# Altium project EzRing.PrjPcb
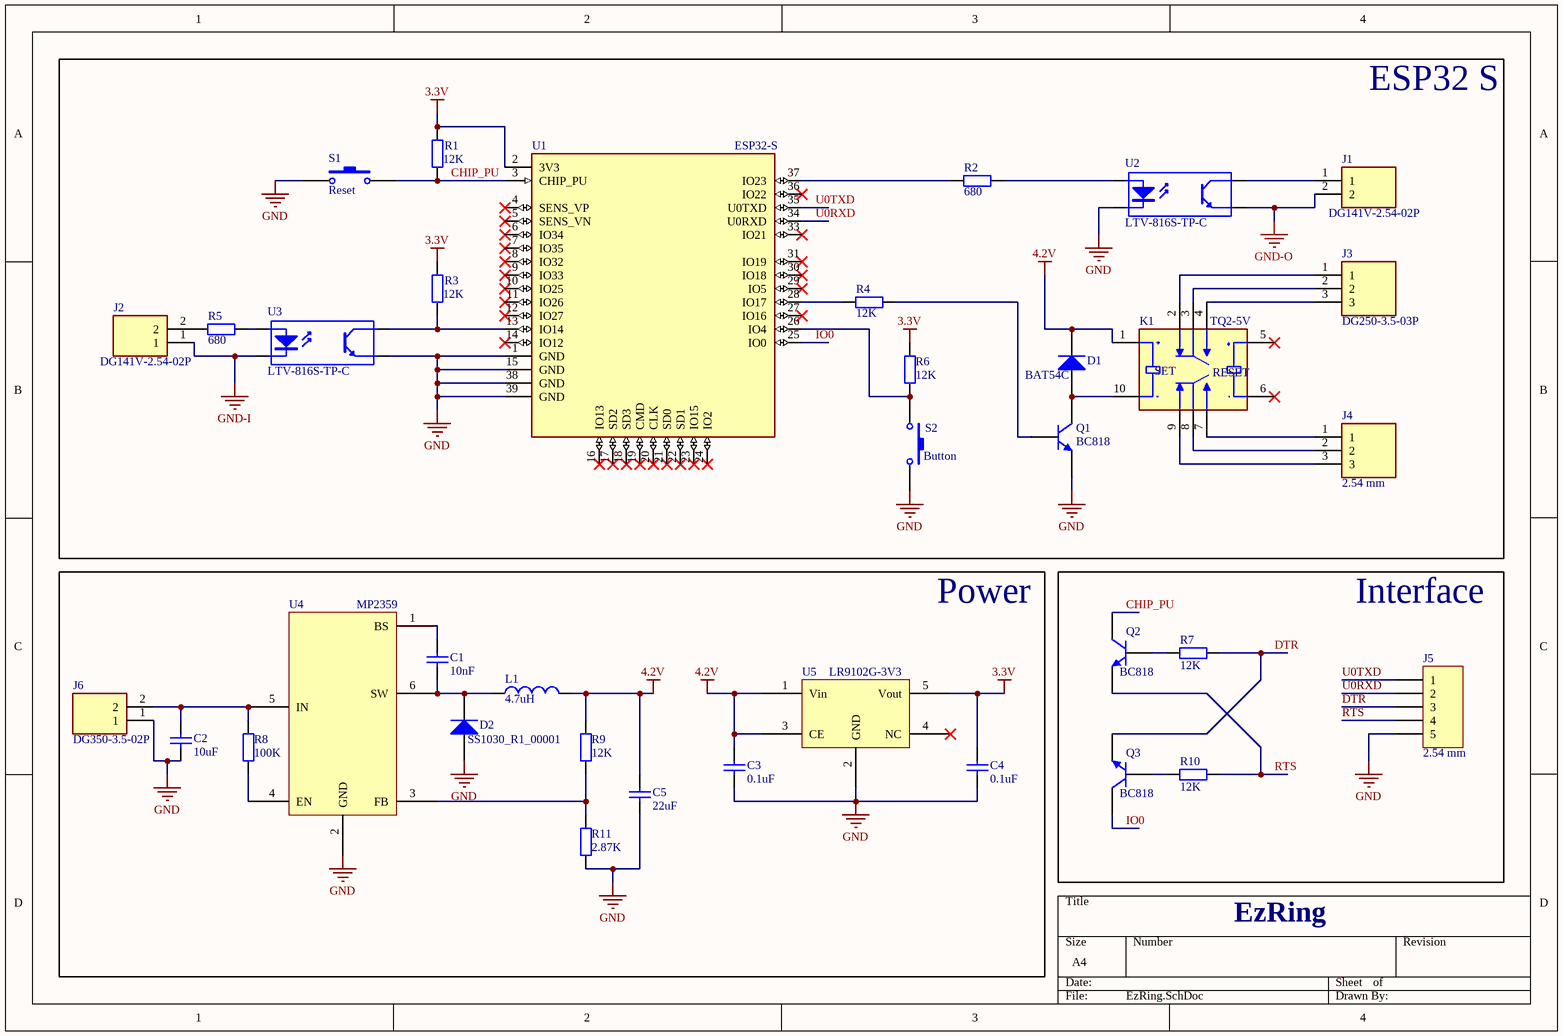
[diagram p0: EzRing.SchDoc]
1 sheet, 36 parts. Net scope: global (net labels, ports and power ports of the same name join across sheets).
Board file: EzRing.PcbDoc

## Sheet EzRing.SchDoc
size A4

### Parts
C1  10nF  [0805]
C2  10uF  [0805]
C3  0.1uF  [0805]
C4  0.1uF  [0805]
C5  22uF  [0805]
D1  BAT54C  [BAT54 series]
D2  SS1030_R1_00001  [SOD123 DIODE]
J1  DG141V-2.54-02P  [term blk 2p 2.54 2 leg 5.08 between legs]
J2  DG141V-2.54-02P  [term blk 2p 2.54 2 leg 5.08 between legs]
J3  DG250-3.5-03P  [term blk 2.54 3p 2 leg 5.08  between leg]
J4  2.54 mm  [HEADER-2.54-03]
J5  2.54 mm  [HEADER-2.54-5P]
J6  DG350-3.5-02P  [Header-3.5-02]
K1  TQ2-5V  [RELAY_TQ2_2C_PAN]
L1  4.7uH  [INDC2012X10N]
Q1  BC818  [BC818]
Q2  BC818  [BC818]
Q3  BC818  [BC818]
R1  12K  [0805]
R2  680  [0805]
R3  12K  [0805]
R4  12K  [0805]
R5  680  [AXIAL-0.4]
R6  12K  [0805]
R7  12K  [0805]
R8  100K  [0805]
R9  12K  [0805]
R10  12K  [0805]
R11  2.87K  [0805]
S1  Reset  [Kısa Devre anahtarlaması]
S2  Button  [Push Button]
U1  ESP32-S  [ESP-32S]
U2  LTV-816S-TP-C  [OPTO LTV-816S]
U3  LTV-816S-TP-C  [OPTO LTV-816S]
U4  MP2359  [MP2359 vol reg TSOT23-6]
U5  LR9102G-3V3  [LR9102G-3V3-AE5-R]

### Blocks framed on the sheet
ESP32 S: D1 J1-J4 K1 Q1 R1-R6 S1 S2 U1-U3
Interface: J5 Q2 Q3 R7 R10

### Nets
3.3V: C4.2 R1.1 R3.1 R6.2 U1.2(3V3) U5.5(Vout)
4.2V: C3.2 C5.2 D1.2(K) K1.1 L1.2 R9.2 U5.1(Vin) U5.3(CE)
GND: C2.1 C3.1 C4.1 C5.1 D2.1(A) J5.5 J6.1 Q1.3(E) R11.1 S1.1 S2.2 U1.1(GND) U1.15(GND) U1.38(GND) U1.39(GND) U2.2(K) U3.3(E) U4.2(GND) U5.2(GND)
GND-I: J2.1 U3.2(K)
GND-O: J1.2 U2.3(E)
NetC1_1: C1.1 D2.2(K) L1.1 U4.6(SW)
NetC1_2: C1.2 U4.1(BS)
NetC2_2: C2.2 J6.2 R8.2 U4.5(IN)
NetD1_1: D1.1(A) K1.10 Q1.1(C)
NetJ1_1: J1.1 U2.4(C)
NetJ2_2: J2.2 R5.1
NetJ3_1: J3.1 K1.2
NetJ3_2: J3.2 K1.3
NetJ3_3: J3.3 K1.4
NetJ4_1: J4.1 K1.7
NetJ4_2: J4.2 K1.8
NetJ4_3: J4.3 K1.9
NetQ1_2: Q1.2(B) R4.1
NetQ2_2: Q2.2(B) R7.1
NetQ2_3: Q2.3(E) R10.2
NetQ3_2: Q3.2(B) R10.1
NetQ3_3: Q3.3(E) R7.2
NetR1_2: R1.2 S1.2 U1.3(CHIP_PU)
NetR2_1: R2.1 U1.37(IO23)
NetR2_2: R2.2 U2.1(A)
NetR3_2: R3.2 U1.13(IO14) U3.4(C)
NetR4_2: R4.2 U1.28(IO17)
NetR5_2: R5.2 U3.1(A)
NetR6_1: R6.1 S2.1 U1.26(IO4)
NetR8_1: R8.1 U4.4(EN)
NetR9_1: R9.1 R11.2 U4.3(FB)

Not connected (* = marked no-connect by the designer): J5 1 2 3 4; K1 5* 6*; Q2 1(C); Q3 1(C); U1 4(SENS_VP)* 5(SENS_VN)* 6(IO34)* 7(IO35)* 8(IO32)* 9(IO33)* 10(IO25)* 11(IO26)* 12(IO27)* 14(IO12)* 16(IO13)* 17(SD2)* 18(SD3)* 19(CMD)* 20(CLK)* 21(SD0)* 22(SD1)* 23(IO15)* 24(IO2)* 25(IO0) 27(IO16)* 29(IO5)* 30(IO18)* 31(IO19)* 33(IO21)* 34(U0RXD) 35(U0TXD) 36(IO22)*; U5 4(NC)*

### Notes on the sheet
- (near R1) CHIP_PU
- (near U1) U0TXD
- (near U1) U0RXD
- IO0
- Power
- CHIP_PU
- DTR
- (near J5) U0TXD
- (near J5) U0RXD
- RTS
- (near Q3) IO0
- EzRing
- (in symbol EE2-3TNUH-L) SET; RESET

### Library data of the parts
C1 = Cap: MLCC (2012) 0805 10nF 100VDC ±10% X7R /; Ozdisan Part#: CL21B103KCANNNC; Published: 8-Jun-2000; LatestRevisionDate: 17-Jul-2002; LatestRevisionNote: Re-released for DXP Platform.; PackageReference: RAD-0.3; Publisher: Altium Limited; PackageDescription: Radial Cap, Thru-Hole; 2 Leads; 0.3 in Pin Spacing; Value: 10nF; ComponentLink1Description: Ozdisan; ComponentLink1URL: https://ozdisan.com/pasif-komponentler/kondansatorler/smt-smd-ve-mlcc-kondansatorler/CL21B103KCANNNC
C2 = Cap: MLCC (2012) 0805 10uF 25VDC ±10% X5R /; Ozdisan Part#: CL21A106KAYNNNE; Published: 8-Jun-2000; LatestRevisionDate: 17-Jul-2002; LatestRevisionNote: Re-released for DXP Platform.; PackageReference: RAD-0.3; Publisher: Altium Limited; PackageDescription: Radial Cap, Thru-Hole; 2 Leads; 0.3 in Pin Spacing; Value: 10uF; ComponentLink1Description: Ozdisan; ComponentLink1URL: https://ozdisan.com/pasif-komponentler/kondansatorler/smt-smd-ve-mlcc-kondansatorler/CL21A106KAYNNNE
C3 C4 = Cap: Capacitor; Ozdisan Part#: CL21A226MAQNNNE; Published: 8-Jun-2000; LatestRevisionDate: 17-Jul-2002; LatestRevisionNote: Re-released for DXP Platform.; PackageReference: RAD-0.3; Publisher: Altium Limited; PackageDescription: Radial Cap, Thru-Hole; 2 Leads; 0.3 in Pin Spacing; ComponentLink1Description: Ozdisan; ComponentLink1URL: https://ozdisan.com/pasif-komponentler/kondansatorler/smt-smd-ve-mlcc-kondansatorler/CL21A226MAQNNNE
C5 = Cap: MLCC (2012) 0805 22uF 6.3VDC ±20% X5R /; Ozdisan Part#: CL21A226MQQNNNE; Published: 8-Jun-2000; LatestRevisionDate: 17-Jul-2002; LatestRevisionNote: Re-released for DXP Platform.; PackageReference: RAD-0.3; Publisher: Altium Limited; PackageDescription: Radial Cap, Thru-Hole; 2 Leads; 0.3 in Pin Spacing; Value: 22uF; ComponentLink1Description: Ozdisan; ComponentLink1URL: https://ozdisan.com/pasif-komponentler/kondansatorler/smt-smd-ve-mlcc-kondansatorler/CL21A226MQQNNNE
D1 = Diode: DIODE SCHOTTKY 2*0.2A 30V SOT23 CATHODE PHILIPS; Ozdisan Part#: BAT54C,215; Published: 8-Jun-2000; LatestRevisionDate: 17-Jul-2002; LatestRevisionNote: Re-released for DXP Platform.; PackageVersion: Sep-1996; PackageReference: SMC; Publisher: Altium Limited; PackageDescription: DO-214-AB/SMC; 2 C-Bend Leads; Body 7.9 x 5.9 mm, inc. leads (LxW); Code_JEDEC: DO-214-AB; ComponentLink1Description: Ozdisan; ComponentLink1URL: https://www.ozdisan.com/guc-yari-iletkenleri/diyotlar-modul-diyotlar-ve-dogrultucular/schottky-diyotlar/BAT54C215
D2 = Diode: DIODE SCHOTTKY 1A 30V SOD123 SMT; Published: 8-Jun-2000; LatestRevisionDate: 17-Jul-2002; LatestRevisionNote: Re-released for DXP Platform.; PackageVersion: Sep-1996; PackageReference: SMC; Publisher: Altium Limited; PackageDescription: DO-214-AB/SMC; 2 C-Bend Leads; Body 7.9 x 5.9 mm, inc. leads (LxW); Code_JEDEC: DO-214-AB; Ozdisan Part#: SS1030_R1_00001; ComponentLink1Description: Ozdisan; ComponentLink1URL: https://www.ozdisan.com/guc-yari-iletkenleri/diyot-modul-diyot-dogrultucular/schottky-diyotlar/SS1030R100001
J1 J2 = 282843-2: Ozdisan Part#: DG141V-2.54-02P-14-00AH; MF: {'manufacturer': 'TE Connectivity'}; Availability: Unavailable; MP: 282843-2; Value: *; Package: None; Price: None; ComponentLink1Description: Ozdisan
  J2: ComponentLink1URL: https://ozdisan.com/konnektor-ve-baglanti-elemanlari/klemensler/pcb-klemensler/DG141V-2-54-02P-14-00AH
J3 = 282843-3: TERM.BLK.3.50MM 3P PCB TYPE GRAY GAOSONG; Ozdisan Part#: DG141V-2.54-03P-14-00AH; MF: TE Connectivity; DigiKey-Purchase-URL: https://snapeda.com/shop?store=DigiKey&id=2375700; Package: None; Digi-Key_Part_Number: A98085-ND; EU_RoHS_Compliance: Compliant with Exemptions; SnapEDA_Link: https://www.snapeda.com/parts/282843-3/TE%20Connectivity%20AMP%20Connectors/view-part/2375700/?ref=snap; Value: *; ComponentLink1Description: Ozdisan; ComponentLink1URL: https://ozdisan.com/konnektor-ve-baglanti-elemanlari/klemensler/pcb-klemensler/DG141V-2-54-03P-14-00AH
J4 = 282843-3: TERMI-BLOCK PCB HEADER 2.54; MF: TE Connectivity; DigiKey-Purchase-URL: https://snapeda.com/shop?store=DigiKey&id=2375700; Package: None; Digi-Key_Part_Number: A98085-ND; EU_RoHS_Compliance: Compliant with Exemptions; SnapEDA_Link: https://www.snapeda.com/parts/282843-3/TE%20Connectivity%20AMP%20Connectors/view-part/2375700/?ref=snap; ComponentLink1Description: Ozdisan
J5 = Header 5: Header, 5-Pin boşta kalacak.; Pitch: 3.5; LatestRevisionDate: 17-Jul-2002; LatestRevisionNote: Re-released for DXP Platform.; Publisher: Altium Limited
J6 = 282843-2: TERM.BLK.3.81MM 2P PCB TYPE GREEN GAOSONG; Ozdisan Part#: DG350-3.5-02P-14-02AH; MF: {'manufacturer': 'TE Connectivity'}; Availability: Unavailable; MP: 282843-2; Value: *; Package: None; Price: None; ComponentLink1Description: Ozdisan; ComponentLink1URL: https://ozdisan.com/konnektor-ve-baglanti-elemanlari/klemensler/pcb-klemensler/DG350-3-5-02P-14-02AH
K1 = EE2-3TNUH-L: RELAY 1A 5VDC TELECOM TYPE PANASONIC; MF: KEMET; Arrow_Electronics-Purchase-URL: https://snapeda.com/shop?store=Arrow+Electronics&id=696044; SnapEDA_Link: https://www.snapeda.com/parts/EE2-3TNUH-L/KEMET/view-part/696044/?ref=snap; DigiKey-Purchase-URL: https://snapeda.com/shop?store=DigiKey&id=696044; Package: None; Availability: Good; Price: None; Mouser-Purchase-URL: https://snapeda.com/shop?store=Mouser&id=696044; MP: EE2-3TNUH-L; Value: *; Ozdisan Part#: TQ2-5V; ComponentLink1Description: Ozdisan; ComponentLink1URL: https://ozdisan.com/Product/Detail/8572/TQ2-5V
L1 = Inductor: INDUCTOR FIXED 0805 4.7UH SMD; Ozdisan Part#: CL2012C-4R7M-N; Code_IEC: 1005; Published: 8-Jun-2000; LatestRevisionDate: 29-May-2009; LatestRevisionNote: IPC-7351 Footprint Added.; PackageReference: 0402-A; Publisher: Altium Limited; PackageDescription: Chip Inductor; Code_JEITA: 0402; Value: 4.7uH; ComponentLink1Description: Ozdisan; ComponentLink1URL: https://ozdisan.com/pasif-komponentler/induktorler/sabit-induktorler/CL2012C-4R7M-N
Q1-Q3 = NPN: BC818-16W,115 - TRANSISTOR DIS.500mA 25V NPN SOT323 GEN. SMT; Published: 8-Jun-2000; LatestRevisionDate: 17-Jul-2002; LatestRevisionNote: Re-released for DXP Platform.; PackageReference: TO-226-AA; Publisher: Altium Limited; PackageDescription: TO, Flat Index; 3 In-Line, Axial Leads; Body Dia. 4.8mm; Leads 0.55 x 0.51 mm (max); Ozdisan Part#: BC818-16W,115; ComponentLink1Description: Ozdisan; ComponentLink1URL: https://www.ozdisan.com/guc-yari-iletkenleri/transistorler/discrete-transistorler/BC818-16W115
R1 R3 R4 R6 R7 R9 R10 = Res2: Resistor; Ozdisan Part#: 0805S8J0123T5E; Published: 8-Jun-2000; LatestRevisionDate: 17-Jul-2002; LatestRevisionNote: Re-released for DXP Platform.; PackageReference: AXIAL-0.4; Publisher: Altium Limited; PackageDescription: Axial Device, Thru-Hole; 2 Leads; 0.4 in Pin Spacing; ComponentLink1Description: Ozdisan
  R1 R3 R7 R9 R10: ComponentLink1URL: https://ozdisan.com/pasif-komponentler/direncler/smt-smd-ve-cip-direncler/0805S8J0123T5E
  R4 R6: ComponentLink1URL: https://www.ozdisan.com/pasif-komponentler/direncler/smt-smd-ve-cip-direncler/0805S8J0123T5E
R2 = Res2: Resistor; Ozdisan Part#: 0805S8J0681T5E; Published: 8-Jun-2000; LatestRevisionDate: 17-Jul-2002; LatestRevisionNote: Re-released for DXP Platform.; PackageReference: AXIAL-0.4; Publisher: Altium Limited; PackageDescription: Axial Device, Thru-Hole; 2 Leads; 0.4 in Pin Spacing; ComponentLink1Description: New link; ComponentLink1URL: https://www.ozdisan.com/pasif-komponentler/direncler/smt-smd-ve-cip-direncler/0805S8J0681T5E
R5 = Res2: Dip Resistor; Ozdisan Part#: MF01WJJ0681A10; Published: 8-Jun-2000; LatestRevisionDate: 17-Jul-2002; LatestRevisionNote: Re-released for DXP Platform.; PackageReference: AXIAL-0.4; Publisher: Altium Limited; PackageDescription: Axial Device, Thru-Hole; 2 Leads; 0.4 in Pin Spacing; ComponentLink1Description: New link; ComponentLink1URL: https://www.ozdisan.com/pasif-komponentler/direncler/tht-dip-direncler/MF01WJJ0681A10
R8 = Res2: Resistor; Ozdisan Part#: 0805S8J0104T5E; Published: 8-Jun-2000; LatestRevisionDate: 17-Jul-2002; LatestRevisionNote: Re-released for DXP Platform.; PackageReference: AXIAL-0.4; Publisher: Altium Limited; PackageDescription: Axial Device, Thru-Hole; 2 Leads; 0.4 in Pin Spacing; ComponentLink1Description: Ozdisan; ComponentLink1URL: https://ozdisan.com/pasif-komponentler/direncler/smt-smd-ve-cip-direncler/0805S8J0104T5E
R11 = Res2: Resistor; Ozdisan Part#: 0805S8F2871T5E; Published: 8-Jun-2000; LatestRevisionDate: 17-Jul-2002; LatestRevisionNote: Re-released for DXP Platform.; PackageReference: AXIAL-0.4; Publisher: Altium Limited; PackageDescription: Axial Device, Thru-Hole; 2 Leads; 0.4 in Pin Spacing; ComponentLink1Description: Ozdisan; ComponentLink1URL: https://www.ozdisan.com/pasif-komponentler/direncler/smt-smd-ve-cip-direncler/0805S8F2871T5E
S1 = SW-PB: Burayı bir cımbız ile kısa devre yapılabilecek bir yapıda bırakacağız. buton koyulmayacak.; Published: 24-Mar-1999; LatestRevisionDate: 17-Jul-2002; LatestRevisionNote: Re-released for DXP Platform.; PackageReference: SPST-2; Publisher: Altium Limited; PackageDescription: Switch; 2 Leads
S2 = SW-PB: PUSH; Ozdisan Part#: L-KLS7-TS6604-4.3-160-T; Published: 24-Mar-1999; LatestRevisionDate: 17-Jul-2002; LatestRevisionNote: Re-released for DXP Platform.; PackageReference: SPST-2; Publisher: Altium Limited; PackageDescription: Switch; 2 Leads; ComponentLink1Description: Ozdisan; ComponentLink1URL: https://www.ozdisan.com/elektromekanik-komponentler/sivicler-ve-anahtarlar/tact-sivicler/L-KLS7-TS6604-4-3-160-T
U1 = ESP32-S: Ozdisan Part#: ESP32-S (32MBIT); ComponentLink1Description: ozdisan; ComponentLink1URL: https://ozdisan.com/Product/Detail/632855/ESP32-S-32MBIT
U2 U3 = Optoisolator1: IC-816 OPTO SMD; Published: 24-Mar-1999; LatestRevisionDate: 04-Mar-2005; LatestRevisionNote: Sch pins 3 & 4 Swapped.; DatasheetVersion: Nov-2003; PackageReference: SMD; Publisher: Altium Limited; ComponentLink1Description: Ozdisan; ComponentLink1URL: https://www.ozdisan.com/optolar-ve-sensorler/optolar/transistor-cikisli-optokuplorler/LTV-816S-TP-C; Ozdisan Part#: LTV-816S-TP-C
U4 = MP2359: IC-2359 V.REG BUCK ADJ 1.2A TSOT23-6; Ozdisan Part#: MP2359DJ-LF-Z; ComponentLink1Description: Ozdisan; ComponentLink1URL: https://ozdisan.com/Product/Detail/625041/MP2359DJ-LF-Z
U5 = LR9102G-3V3: IC-LR9102 V.REG 3V3 SOT-23-5 TR UTC (0-6,6V to 3,3V); ComponentLink1Description: Ozdisan; ComponentLink1URL: https://www.ozdisan.com/entegre-devreler-ics/guc-entegreleri/lineer-voltaj-regulatorleri/LR9102G-3V3-AE5-R; Ozdisan Part#: LR9102G-3V3-AE5-R